# Altium project ACU (ra8m1_unshielded).PrjPcb (part 2 of 3)

## Sheet HighSpeedInterfaces.SchDoc: High Speed Interfaces
size A3; ApprovedBy: Diogo Gomes; CheckedBy: Bruno, Candido, Pedro; Author: João Vieira; CompanyName: LART; DrawnBy: João Vieira; Organization: LART; Address1: Morro do lena; Address2: Alto Do Vieiro; Address3: APT 4163, Building D; Revision: v1.4.2; SheetNumber: 7; SheetTotal: 12; ProjectTitle: Autonomous Control Unit; CheckedBy1: G. Candido; CheckedBy2: F. Chen; CheckedBy3: P. Ferreira; CheckedBy4: B. Vicente; CheckedBy5: _; CheckedBy6: _; CheckedBy7: _; CHK_APP_DATE: --/--/--; DSN_APP_DATE: --/--/--; ENG_APP_DATE: --/--/--; Summary: The various High Speed IOs, for now this only includes Ethernet; version_tag: 1.4.2; ImagePath: C:\Users\micron\Desktop
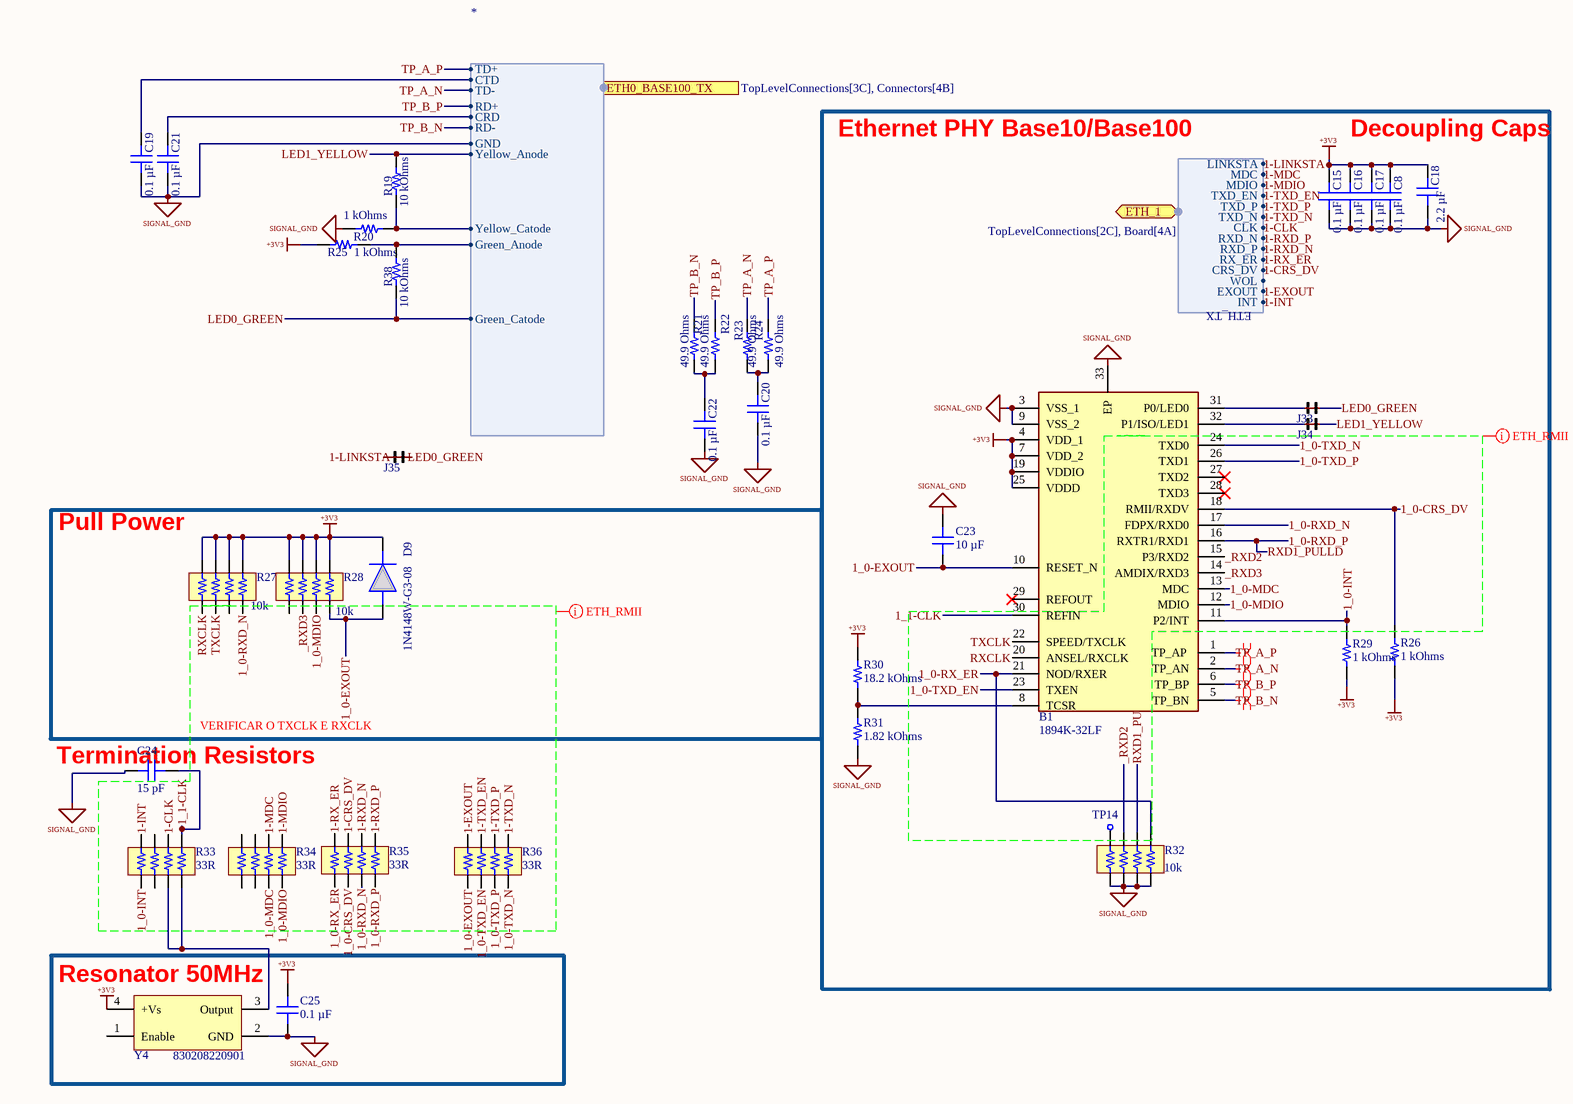
[diagram p5: HighSpeedInterfaces.SchDoc]

### Parts
(Parts that share a designator on the sheet are numbered #1, #2 ... from top to bottom, then left to right.)
B1  1894K-32LF  [1894K-32LF]
C8  0.1 µF  [CAP 0402_1005]
C15#2  0.1 µF  [CAP 0402_1005]
C16#2  0.1 µF  [CAP 0402_1005]
C17#2  0.1 µF  [CAP 0402_1005]
C18  2.2 µF  [CAP 0805_2012]
C19  0.1 µF  [CAP 0402_1005]
C20  0.1 µF  [CAP 0402_1005]
C21  0.1 µF  [CAP 0402_1005]
C22  0.1 µF  [CAP 0402_1005]
C23  10 µF  [CAP 0805_2012]
C24  15 pF  [CAP 0402_1005]
C25#2  0.1 µF  [CAP 0402_1005]
D9  1N4148W-G3-08  [SOD3716X135N]
J33  A solder Bridge  [Solder Bridge 805]  (value not drawn)
J34  A solder Bridge  [Solder Bridge 805]  (value not drawn)
J35  A solder Bridge  [Solder Bridge 805]  (value not drawn)
R19  10 kOhms  [RES 0805_2012]
R20  1 kOhms  [RES 0805_2012]
R21  49.9 Ohms  [RES 0402_1005]
R22  49.9 Ohms  [RES 0402_1005]
R23  49.9 Ohms  [RES 0402_1005]
R24  49.9 Ohms  [RES 0402_1005]
R25  1 kOhms  [RES 0805_2012]
R26  1 kOhms  [RES 0805_2012]
R27  10k  [RESNET 1206-8 CONVEX]
R28  10k  [RESNET 1206-8 CONVEX]
R29  1 kOhms  [RES 0805_2012]
R30  18.2 kOhms  [RES 0805_2012]
R31  1.82 kOhms  [RES 0805_2012]
R32  10k  [RESNET 1206-8 CONVEX]
R33  33R  [RESNET 0804-8 CONVEX]
R34  33R  [RESNET 0804-8 CONVEX]
R35  33R  [RESNET 0804-8 CONVEX]
R36  33R  [RESNET 0804-8 CONVEX]
R38  10 kOhms  [RES 0805_2012]
TP14  TestPad  [Test Pad Small]  (value not drawn)
Y4#2  830208220901  [WE-SPXO_IQXO-791]

### Blocks framed on the sheet
Pull Power: D9 R27 R28
Resonator 50MHz: C25#2 Y4#2

### Ports
ETH0_BASE100_TX (harness *, see TopLevelConnections[3C], Connectors[4B]), ETH_1 (bidir, harness ETH_TX, see TopLevelConnections[2C], Board[4A])

### Harnesses
ETH_TX: MDC, MDIO, TXD_EN, TXD_P, TXD_N, CLK, RXD_N, RXD_P, RX_ER, LINKSTA, CRS_DV, WOL, EXOUT, INT
*: TD+, CTD, TD-, RD+, CRD, RD-, GND, Yellow_Anode, Yellow_Catode, Green_Anode, Green_Catode

### Nets
+3V3: B1.4(VDD_1) B1.7(VDD_2) B1.19(VDDIO) B1.25(VDDD) C8.2 C15#2.2 C16#2.2 C17#2.2 C18.2 C25#2.1 D9.1(K) R25.2 R26.2 R27.1 R27.2 R27.3 R27.4 R28.5 R28.6 R28.7 R28.8 R29.2 R30.2 Y4#2.4(+Vs)
SIGNAL_GND: B1.3(VSS_1) B1.9(VSS_2) B1.33(EP) C8.1 C15#2.1 C16#2.1 C17#2.1 C18.1 C19.1 C20.1 C21.1 C22.1 C23.2 C24.2 C25#2.2 R20.2 R31.1 R32.1 R32.2 R32.3 R32.4 Y4#2.2(GND) ; port ETH0_BASE100_TX.GND
1-CLK: R33.6 ; port ETH_1.CLK
1-CRS_DV: R35.7 ; port ETH_1.CRS_DV
1-EXOUT: R36.8 ; port ETH_1.EXOUT
1-INT: R33.8 ; port ETH_1.INT
1-LINKSTA: J35.P0 ; port ETH_1.LINKSTA
1-MDC: R34.6 ; port ETH_1.MDC
1-MDIO: R34.5 ; port ETH_1.MDIO
1-RX_ER: R35.8 ; port ETH_1.RX_ER
1-RXD_N: R35.6 ; port ETH_1.RXD_P
1-RXD_P: R35.5 ; port ETH_1.RXD_N
1-TXD_EN: R36.7 ; port ETH_1.TXD_EN
1-TXD_N: R36.5 ; port ETH_1.TXD_N
1-TXD_P: R36.6 ; port ETH_1.TXD_P
1_0-CRS_DV: B1.18(RMII/RXDV) R26.1 R35.2  [project net 1_0-CRS_DV_7]
1_0-EXOUT: B1.10(RESET_N) C23.1 D9.2(A) R28.4 R36.1  [project net 1_0-EXOUT_7]
1_0-INT: B1.11(P2/INT) R29.1 R33.1  [project net 1_0-INT_7]
1_0-MDC: B1.13(MDC) R34.3  [project net 1_0-MDC_7]
1_0-MDIO: B1.12(MDIO) R28.3 R34.4  [project net 1_0-MDIO_7]
1_0-RX_ER: B1.21(NOD/RXER) R32.5 R35.1  [project net 1_0-RX_ER_7]
1_0-RXD_N: B1.17(FDPX/RXD0) R27.8 R35.3  [project net 1_0-RXD_N_7]
1_0-RXD_P: B1.16(RXTR1/RXD1) R32.6 R35.4  [also labelled RXD1_PULLD]  [project net 1_0-RXD_P_7]
1_0-TXD_EN: B1.23(TXEN) R36.2  [project net 1_0-TXD_EN_7]
1_0-TXD_N: B1.24(TXD0) R36.4  [project net 1_0-TXD_N_7]
1_0-TXD_P: B1.26(TXD1) R36.3  [project net 1_0-TXD_P_7]
1_1-CLK: B1.30(REFIN) C24.1 R33.5  [project net 1_1-CLK_7]
_RXD2: B1.15(P3/RXD2) R32.7  [project net _RXD2_7]
_RXD3: B1.14(AMDIX/RXD3) R28.2  [project net _RXD3_7]
LED0_GREEN: J33.P1 J35.P1 R38.1 ; port ETH0_BASE100_TX.Green_Catode
LED1_YELLOW: J34.P1 R19.2 ; port ETH0_BASE100_TX.Yellow_Anode
RXCLK: B1.20(ANSEL/RXCLK) R27.5  [project net RXCLK_7]
TP_A_N: B1.2(TP_AN) R23.2 ; port ETH0_BASE100_TX.TD-
TP_A_P: B1.1(TP_AP) R24.2 ; port ETH0_BASE100_TX.TD+
TP_B_N: B1.5(TP_BN) R21.2 ; port ETH0_BASE100_TX.RD-
TP_B_P: B1.6(TP_BP) R22.2 ; port ETH0_BASE100_TX.RD+
TXCLK: B1.22(SPEED/TXCLK) R27.6  [project net TXCLK_7]
NetB1_8: B1.8(TCSR) R30.1 R31.2
NetB1_31: B1.31(P0/LED0) J33.P0
NetB1_32: B1.32(P1/ISO/LED1) J34.P0
NetC19_2: C19.2 ; port ETH0_BASE100_TX.CTD
NetC20_2: C20.2 R23.1 R24.1
NetC21_2: C21.2 ; port ETH0_BASE100_TX.CRD
NetC22_2: C22.2 R21.1 R22.1
NetR19_1: R19.1 R20.1 ; port ETH0_BASE100_TX.Yellow_Catode
NetR25_1: R25.1 R38.2 ; port ETH0_BASE100_TX.Green_Anode
NetR32_8: R32.8 TP14.P2
NetR33_3: R33.3 R33.4 Y4#2.3(Output)

Not connected (* = marked no-connect by the designer): B1 27(TXD2)* 28(TXD3)* 29(REFOUT)*; R27 7; R28 1; R33 2 7; R34 1 2 7 8; Y4#2 1(Enable)

### Layout directives
differential pair; rule Impedance Constraint [Min = 99.00    Max = 101.0    ]; differential pair class ETH_B; rule Matched Net Lengths [Delay Tolerance = 10ps]; rule Differential Pairs Routing [Pref Gap = 0.127mm    Min Gap  = 0.127mm    Max Gap  = 0.127mmPref Width = 0.108mm    Min Width  = 0.076mm    Max Width  = 0.108mm]: TP_B_P
differential pair; rule Impedance Constraint [Min = 99.00    Max = 101.0    ]; rule Impedance Constraint [Min = 99.00    Max = 101.0    ]; differential pair class ETH_B; rule Matched Net Lengths [Delay Tolerance = 10ps]; rule Differential Pairs Routing [Pref Gap = 0.127mm    Min Gap  = 0.127mm    Max Gap  = 0.127mmPref Width = 0.108mm    Min Width  = 0.076mm    Max Width  = 0.108mm]: TP_B_N
differential pair; differential pair class ETH_A; rule Matched Net Lengths [Delay Tolerance = 10ps]; rule Differential Pairs Routing [Pref Gap = 0.127mm    Min Gap  = 0.127mm    Max Gap  = 0.127mmPref Width = 0.108mm    Min Width  = 0.076mm    Max Width  = 0.108mm]: TP_A_P
differential pair; rule Impedance Constraint [Min = 99.00    Max = 101.0    ]; differential pair class ETH_A; rule Matched Net Lengths [Delay Tolerance = 10ps]; rule Differential Pairs Routing [Pref Gap = 0.127mm    Min Gap  = 0.127mm    Max Gap  = 0.127mmPref Width = 0.108mm    Min Width  = 0.076mm    Max Width  = 0.108mm]: TP_A_N
rule Width Constraint [Pref Impedance = 50.00ohms    Min Impedance = 50.00ohms    Max Impedance = 50.00ohms]: 1-CLK, 1-CRS_DV, 1-EXOUT, 1-INT, 1-MDC, 1-MDIO, 1-RX_ER, 1-RXD_N, 1-RXD_P, 1-TXD_EN, 1-TXD_N, 1-TXD_P, 1_0-CRS_DV, 1_0-EXOUT, 1_0-INT, 1_0-MDC, 1_0-MDIO, 1_0-RX_ER, 1_0-RXD_N, 1_0-RXD_P, 1_0-TXD_EN, 1_0-TXD_N, 1_0-TXD_P, 1_1-CLK, _RXD2, _RXD3, RXCLK, RXD1_PULLD, TXCLK

### Notes on the sheet
- Ethernet PHY Base10/Base100
- Decoupling Caps
- (near C24) VERIFICAR O TXCLK E RXCLK
- (near C24) Termination Resistors
- Title:
- Author:
- Checked By:
- Approved:
- Size:
- Date:
- Git Hash:
- A3
- Prj:
- Variant:
- SW Version:
- Description:

### Library data of the parts
B1 = 1894K-32LF: The IDT1894-32 is a low-power, physical-layer device (PHY) that supports the ISO/IEC 10Base-T and 100Base-TX Carrier-Sense Multiple Access/Collision Detection (CSMA/CD) Ethernet standards, ISO/IEC 8802-3. The IDT1894-32 is intended for MII, Node applications that require the Auto-MDIX feature that automatically corrects crossover errors in plant wiring. The IDT1894-32 incorporates Digital-Signal Processing (DSP) control in its Physical-Medium Dependent (PMD) sub layer. As a result, it can transmit and recei; Manufacturer_Name: Renesas Electronics; Geometry.Height: 1mm; Manufacturer_Part_Number: 1894K-32LF; Mouser Part Number: 972-1894K-32LF; Mouser Price/Stock: https://www.mouser.co.uk/ProductDetail/Renesas-IDT/1894K-32LF?qs=JcGQCygHkIbsoRijcJxryA%3D%3D; Arrow Part Number: *; Arrow Price/Stock: *; Datasheet Link: https://www.idt.com/document/dst/1894-32-datasheet
C8 C15#2 C16#2 C17#2 C19-C22 C25#2 = CL05B104KP5VPNC: CAP CER 100NF 10V X7R 0402; manufacturer: Samsung Electro-Mechanics; Tolerance: ±10%; Part Number: CL05B104KP5VPNC; Value: 0.1 µF; Applications: Automotive; Capacitance: 0.1 µF; componentlink1description: Datasheet; componentlink1url: https://mm.digikey.com/Volume0/opasdata/d220001/medias/docus/5458/CL05B104KP5VPNC_Spec.pdf; componentlink2description: DigiKey Link; componentlink2url: https://www.digikey.com/en/products/detail/samsung-electro-mechanics/CL05B104KP5VPNC/20498482; Device Package: 0402 (1005 Metric); lastupdated: 02/02/2024 20:03:11; Lifecycle Status: Active; Minimum Order: 1; Mounting Type: Surface Mount, MLCC; Operating Temperature: -55°C ~ 125°C; Package / Case: 0402 (1005 Metric); packaging: TapeAndReel; partid: 56690; price: 0.01; Ratings: AEC-Q200; series: CL; Size / Dimension: 0.039" L x 0.020" W (1.00mm x 0.50mm); Supplier 1: DigiKey; Supplier Part Number 1: 1276-CL05B104KP5VPNCCT-ND; Temperature Coefficient: X7R; Thickness (Max): 0.022" (0.55mm); Voltage - Rated: 10V
C18 = 0805B225K250CT: CAP CER 2.2UF 25V X7R 0805; manufacturer: Walsin Technology Corporation; Tolerance: ±10%; Part Number: 0805B225K250CT; Value: 2.2 µF; Applications: General Purpose; Capacitance: 2.2 µF; componentlink1description: Datasheet; componentlink1url: https://www.passivecomponent.com/wp-content/uploads/datasheet/WTC_MLCC_General_Purpose.pdf; componentlink2description: DigiKey Link; componentlink2url: https://www.digikey.com/en/products/detail/walsin-technology-corporation/0805B225K250CT/14836806; Device Package: 0805 (2012 Metric); lastupdated: 09/02/2024 20:15:01; Lifecycle Status: Active; Minimum Order: 1; Mounting Type: Surface Mount, MLCC; Operating Temperature: -55°C ~ 125°C; Package / Case: 0805 (2012 Metric); packaging: TapeAndReel; partid: 40661; Part Status: Active; price: 0.03; series: -; Size / Dimension: 0.079" L x 0.049" W (2.00mm x 1.25mm); Supplier 1: DigiKey; Supplier Part Number 1: 1292-0805B225K250CT-ND; Temperature Coefficient: X7R; Thickness (Max): 0.057" (1.45mm); Voltage - Rated: 25V
C23 = NMC0805X5R106K6.3TRPLP2KF: CAP SMT080510F6.3VDC 10uF Specialised; manufacturer: NIC Components Corp; Temperature Coefficient: X5R; Tolerance: ±10%; Voltage - Rated: 6.3V; Part Number: NMC0805X5R106K6.3TRPLP2KF; Value: 10 µF; Applications: General Purpose; Capacitance: 10 µF; componentlink1description: Datasheet; componentlink1url: https://www.niccomp.com/quickbuilder/qbpn.php?pNumber=NMC0805X5R106K6.3TRPLP2KF; componentlink2description: DigiKey Link; componentlink2url: https://www.digikey.com/en/products/detail/nic-components-corp/NMC0805X5R106K6-3TRPLP2KF/18896026; Device Package: 0805 (2012 Metric); Features: Low ESL, Low ESR; lastupdated: 09/02/2024 20:13:27; Lifecycle Status: Active; Minimum Order: 1; Mounting Type: Surface Mount, MLCC; Operating Temperature: -55°C ~ 85°C; Package / Case: 0805 (2012 Metric); packaging: TapeAndReel; partid: 56029; price: 0.03; series: NMC High CV; Size / Dimension: 0.079" L x 0.049" W (2.00mm x 1.25mm); Supplier 1: DigiKey; Supplier Part Number 1: 4988-NMC0805X5R106K6.3TRPLP2KFCT-ND; Thickness (Max): 0.057" (1.45mm)
C24 = CBR04C150J5GAC: CAP CER 15PF 50V C0G/NP0 0402; manufacturer: KEMET; Temperature Coefficient: C0G, NP0; Tolerance: ±5%; Part Number: CBR04C150J5GAC; Value: 15 pF; Applications: RF, Microwave, High Frequency; Capacitance: 15 pF; componentlink1description: Datasheet; componentlink1url: https://api.kemet.com/component-edge/download/datasheet/CBR04C150J5GAC.pdf; componentlink2description: DigiKey Link; componentlink2url: https://www.digikey.com/en/products/detail/kemet/CBR04C150J5GAC/2732287; Device Package: 0402 (1005 Metric); Features: High Q, Low Loss, Ultra Low ESR; lastupdated: 09/02/2024 20:04:38; Lifecycle Status: Active; Minimum Order: 1; Mounting Type: Surface Mount, MLCC; Operating Temperature: -55°C ~ 125°C; Package / Case: 0402 (1005 Metric); packaging: TapeAndReel; partid: 1728; Part Status: Active; price: 0.02; series: CBR-SMD RF C0G; Size / Dimension: 0.039" L x 0.020" W (1.00mm x 0.50mm); Supplier 1: DigiKey; Supplier Part Number 1: 399-6170-1-ND; Thickness (Max): 0.022" (0.55mm); Voltage - Rated: 50V
D9 = 1N4148W-G3-08: Diodes - General Purpose, Power, Switching 100 Volt 150mA 4ns 500mA IFSM; Manufacturer_Name: Vishay; Geometry.Height: 1.35mm; Manufacturer_Part_Number: 1N4148W-G3-08; Mouser Part Number: 78-1N4148W-G3-08; Mouser Price/Stock: https://www.mouser.co.uk/ProductDetail/Vishay-Semiconductors/1N4148W-G3-08?qs=uS%252BVSIFnvp46StDBB15x4Q%3D%3D; Arrow Part Number: 1N4148W-G3-08; Arrow Price/Stock: https://www.arrow.com/en/products/1n4148w-g3-08/vishay; Datasheet Link: https://componentsearchengine.com/Datasheets/1/1N4148W-G3-08.pdf
J33-J35 = Solder Bridge 805
R19 R38 = RNCS0805BKE10K0: RES 10K OHM 0.1% 1/10W 0805; Manufacturer: Stackpole Electronics Inc; Power (Watts): 0.1W, 1/10W; Temperature Coefficient: ±25ppm/°C; Part Number: RNCS0805BKE10K0; Value: 10 kOhms; ComponentLink1Description: Datasheet; ComponentLink1URL: https://www.seielect.com/catalog/sei-rncs_rnch.pdf; ComponentLink2Description: DigiKey Link; ComponentLink2URL: https://www.digikey.com/en/products/detail/stackpole-electronics-inc/RNCS0805BKE10K0/1800067; Composition: Thin Film; Device Package: 0805 (2012 Metric); Features: Anti-Corrosive, Automotive AEC-Q200, Moisture Resistant; Height - Seated (Max): 0.026" (0.65mm); LastUpdated: 02/02/2024 21:00:48; Lifecycle Status: Active; Minimum Order: 1; Number of Terminations: 2; Operating Temperature: -55°C ~ 155°C; Package / Case: 0805 (2012 Metric); Packaging: TapeAndReel; PartId: 27713; Part Status: Active; Price: 0.07; Ratings: AEC-Q200; Resistance: 10 kOhms; Series: RNCS; Size / Dimension: 0.079" L x 0.049" W (2.00mm x 1.25mm); Supplier 1: DigiKey; Supplier Part Number 1: RNCS0805BKE10K0CT-ND; Supplier Device Package: 0805; Tolerance: ±0.1%
R20 R25 R26 R29 = RNCS0805BKE1K00: RES 1K OHM 0.1% 1/10W 0805; Manufacturer: Stackpole Electronics Inc; Power (Watts): 0.1W, 1/10W; Temperature Coefficient: ±25ppm/°C; Part Number: RNCS0805BKE1K00; Value: 1 kOhms; ComponentLink1Description: Datasheet; ComponentLink1URL: https://www.seielect.com/catalog/sei-rncs_rnch.pdf; ComponentLink2Description: DigiKey Link; ComponentLink2URL: https://www.digikey.com/en/products/detail/stackpole-electronics-inc/RNCS0805BKE1K00/1800073; Composition: Thin Film; Device Package: 0805 (2012 Metric); Features: Anti-Corrosive, Automotive AEC-Q200, Moisture Resistant; Height - Seated (Max): 0.026" (0.65mm); LastUpdated: 02/02/2024 21:00:48; Lifecycle Status: Active; Minimum Order: 1; Number of Terminations: 2; Operating Temperature: -55°C ~ 155°C; Package / Case: 0805 (2012 Metric); Packaging: TapeAndReel; PartId: 27715; Part Status: Active; Price: 0.07; Ratings: AEC-Q200; Resistance: 1 kOhms; Series: RNCS; Size / Dimension: 0.079" L x 0.049" W (2.00mm x 1.25mm); Supplier 1: DigiKey; Supplier Part Number 1: RNCS0805BKE1K00CT-ND; Supplier Device Package: 0805; Tolerance: ±0.1%
R21-R24 = CRCW040249R9FKTD: RES SMD 49.9 OHM 1% 1/16W 0402; Manufacturer: Vishay Dale; Power (Watts): 0.063W, 1/16W; Temperature Coefficient: ±100ppm/°C; Part Number: CRCW040249R9FKTD; Value: 49.9 Ohms; ComponentLink1Description: Datasheet; ComponentLink1URL: http://www.vishay.com/docs/20008/dcrcw.pdf; ComponentLink2Description: DigiKey Link; ComponentLink2URL: https://www.digikey.com/en/products/detail/vishay-dale/CRCW040249R9FKTD/1221372; Composition: Thick Film; Device Package: 0402 (1005 Metric); Features: Automotive AEC-Q200; Height - Seated (Max): 0.016" (0.40mm); LastUpdated: 09/02/2024 20:30:10; Lifecycle Status: Active; Minimum Order: 1; Number of Terminations: 2; Operating Temperature: -55°C ~ 155°C; Package / Case: 0402 (1005 Metric); Packaging: TapeAndReel; PartId: 5707; Part Status: Active; Price: 0.01; Ratings: AEC-Q200; Resistance: 49.9 Ohms; Series: CRCW; Size / Dimension: 0.039" L x 0.020" W (1.00mm x 0.50mm); Supplier 1: DigiKey; Supplier Part Number 1: 541-2963-1-ND; Supplier Device Package: 0402; Tolerance: ±1%
R27 R28 R32 = ACASA1001S1002P100: RES ARRAY 4 RES MULT OHM 1206; Manufacturer: Vishay Beyschlag; Circuit Type: Isolated; Number of Resistors: 4; Power Per Element: 100mW; Resistance (Ohms): 1k, 10k; Resistor Matching Ratio: ±0.05%; Resistor-Ratio-Drift: ±15ppm/°C; Temperature Coefficient: ±25ppm/°C; Tolerance: ±0.1%; Part Number: ACASA1001S1002P100; Applications: Voltage Divider (TCR Matched); ComponentLink1Description: Datasheet; ComponentLink1URL: http://www.vishay.com/docs/28751/acasprec.pdf; ComponentLink2Description: DigiKey Link; ComponentLink2URL: http://digikey.com/product-detail/en/vishay-beyschlag/ACASA1001S1002P100/749-1017-1-ND/4741023; Height - Seated (Max): 0.022" (0.55mm); LastUpdated: 02/02/2024 21:35:30; Lifecycle Status: Active; Minimum Order: 1; Mounting Type: Surface Mount; Number of Pins: 8; Operating Temperature: -55°C ~ 125°C; Package / Case: 1206 (3216 Metric), Convex, Long Side Terminals; Packaging: TapeAndReel; PartId: 354; Part Status: Active; Price: 0.24; Series: ACA - Precision; Size / Dimension: 0.126" L x 0.059" W (3.20mm x 1.50mm); Supplier 1: DigiKey; Supplier Part Number 1: 749-1017-1-ND
R30 = RN73C2A18K2BTDF: RES SMD 18.2KOHM 0.1% 1/10W 0805; Manufacturer: TE Connectivity Passive Product; Power (Watts): 0.1W, 1/10W; Temperature Coefficient: ±10ppm/°C; Part Number: RN73C2A18K2BTDF; Value: 18.2 kOhms; ComponentLink1Description: Datasheet; ComponentLink1URL: https://www.te.com/commerce/DocumentDelivery/DDEController?Action=srchrtrv&DocNm=1773270&DocType=DS&DocLang=English; ComponentLink2Description: DigiKey Link; ComponentLink2URL: https://www.digikey.com/en/products/detail/te-connectivity-passive-product/RN73C2A18K2BTDF/2373970; Composition: Thin Film; Device Package: 0805 (2012 Metric); Height - Seated (Max): 0.026" (0.65mm); LastUpdated: 08/02/2024 21:02:38; Lifecycle Status: Active; Minimum Order: 1; Number of Terminations: 2; Operating Temperature: -55°C ~ 155°C; Package / Case: 0805 (2012 Metric); Packaging: TapeAndReel; PartId: 27941; Part Status: Active; Price: 0.36; Resistance: 18.2 kOhms; Series: RN73, Holsworthy; Size / Dimension: 0.079" L x 0.049" W (2.00mm x 1.25mm); Supplier 1: DigiKey; Supplier Part Number 1: A103339CT-ND; Supplier Device Package: 0805; Tolerance: ±0.1%
R31 = RG2012P-1821-B-T5: RES SMD 1.82K OHM 0.1% 1/8W 0805; Manufacturer: Susumu; Power (Watts): 0.125W, 1/8W; Temperature Coefficient: ±25ppm/°C; Part Number: RG2012P-1821-B-T5; Value: 1.82 kOhms; ComponentLink1Description: Datasheet; ComponentLink1URL: http://www.susumu.co.jp/common/pdf/n_catalog_partition01_en.pdf; ComponentLink2Description: DigiKey Link; ComponentLink2URL: https://www.digikey.com/en/products/detail/susumu/RG2012P-1821-B-T5/1240695; Composition: Thin Film; Device Package: 0805 (2012 Metric); Features: Anti-Sulfur, Automotive AEC-Q200; Height - Seated (Max): 0.020" (0.50mm); LastUpdated: 08/02/2024 21:02:32; Lifecycle Status: Active; Minimum Order: 1; Number of Terminations: 2; Operating Temperature: -55°C ~ 155°C; Package / Case: 0805 (2012 Metric); Packaging: TapeAndReel; PartId: 29209; Part Status: Active; Price: 0.05; Ratings: AEC-Q200; Resistance: 1.82 kOhms; Series: RG; Size / Dimension: 0.079" L x 0.049" W (2.00mm x 1.25mm); Supplier 1: DigiKey; Supplier Part Number 1: RG20P1.82KBCT-ND; Supplier Device Package: 0805; Tolerance: ±0.1%
R33-R36 = EXB-28V433JX: RES ARRAY 4 RES 43K OHM 0804; Manufacturer: Panasonic Electronic Components; Circuit Type: Isolated; Number of Resistors: 4; Power Per Element: 62.5mW; Temperature Coefficient: ±200ppm/°C; Tolerance: ±5%; Part Number: EXB-28V433JX; Applications: Automotive AEC-Q200; ComponentLink1Description: Datasheet; ComponentLink1URL: https://industrial.panasonic.com/cdbs/www-data/pdf/AOC0000/AOC0000C14.pdf; ComponentLink2Description: DigiKey Link; ComponentLink2URL: https://www.digikey.com/en/products/detail/panasonic-electronic-components/EXB-28V433JX/417403; Height - Seated (Max): 0.018" (0.45mm); LastUpdated: 02/02/2024 21:35:40; Lifecycle Status: Active; Minimum Order: 1; Mounting Type: Surface Mount; Number of Pins: 8; Operating Temperature: -55°C ~ 125°C; Package / Case: 0804, Convex, Long Side Terminals; Packaging: TapeAndReel; PartId: 428; Part Status: Active; Price: 0.03; Resistance (Ohms): 43k; Series: EXB; Size / Dimension: 0.079" L x 0.039" W (2.00mm x 1.00mm); Supplier 1: DigiKey; Supplier Part Number 1: Y7433CT-ND; Supplier Device Package: 0804
Y4#2 = 830208220901: WE-SPXO Simple Packaged Quartz Oscillator, SMT, IQXO-791, 50MHz, 3.3V; Manufacturer: Wurth Elektronik; Frequency Stability: +/-25ppm; ComponentLink1Description: Website Link; ComponentLink1URL: https://www.we-online.com/redexpert/article/830208220901?ad; ComponentLink2Description: Datasheet Link; ComponentLink2URL: https://www.we-online.com/redexpert/spec/830208220901?ad; Manufacturer Part Number: 830208220901; Category: Oscillators; Match Code: WE-SPXO; Mount: Surface Mount; Operating Temperature Max: 70°C; Operating Temperature Min: -20°C; Packaging: Tape and Reel; Case/Size Code: IQXO-791; Length: 2.5mm; Width: 2mm; Height: 1mm; Frequency: 50MHz; Supply Voltage: 3.3V

## Sheet Power.SchDoc: Power
size A3; ApprovedBy: Diogo Gomes; CheckedBy: Bruno, Candido, Pedro; Author: João Vieira; CompanyName: LART; DrawnBy: João Vieira; Organization: LART; Address1: Morro do lena; Address2: Alto Do Vieiro; Address3: APT 4163, Building D; Revision: v1.4.2; SheetNumber: 8; SheetTotal: 12; ProjectTitle: Autonomous Control Unit; CheckedBy1: G. Candido; CheckedBy2: F. Chen; CheckedBy3: P. Ferreira; CheckedBy4: B. Vicente; CheckedBy5: _; CheckedBy6: _; CheckedBy7: _; CHK_APP_DATE: --/--/--; DSN_APP_DATE: --/--/--; ENG_APP_DATE: --/--/--; Summary: Includes the various reference voltages needed to power all the chips in the ACU; version_tag: 1.4.2; SPICEModelCacheBATJKBWV: <root> / <DocumentId>BATJKBWV</DocumentId> / <CacheFrame Number="0"> / <Model Name="1280_74477005_5.6u" Kind="CKT"> / <Text>******* / .subckt 1280_74477005_5.6u 1 2 / Rp 1 2 5511 / Cp 1 2 8p / Rs 1 N3 0.0105 / L1 N3 2 5.464u / .ends 1280_74477005_5.6u</Text> / </Model> / <Model Name="865060440001_10uf" Kind="CKT"> / <Text>******* / .subckt 865060440001_10uF 1 2 / Rser 1 3 1.81968584275 / Lser 2 4 1.435032181E-09 / C1 3 4 0.00001 / Rpar 3 4 8333333.33333333 / .ends 865060440001_10uF</Text> / </Model> / </CacheFrame> / </root>; ImagePath: C:\Users\micron\Desktop
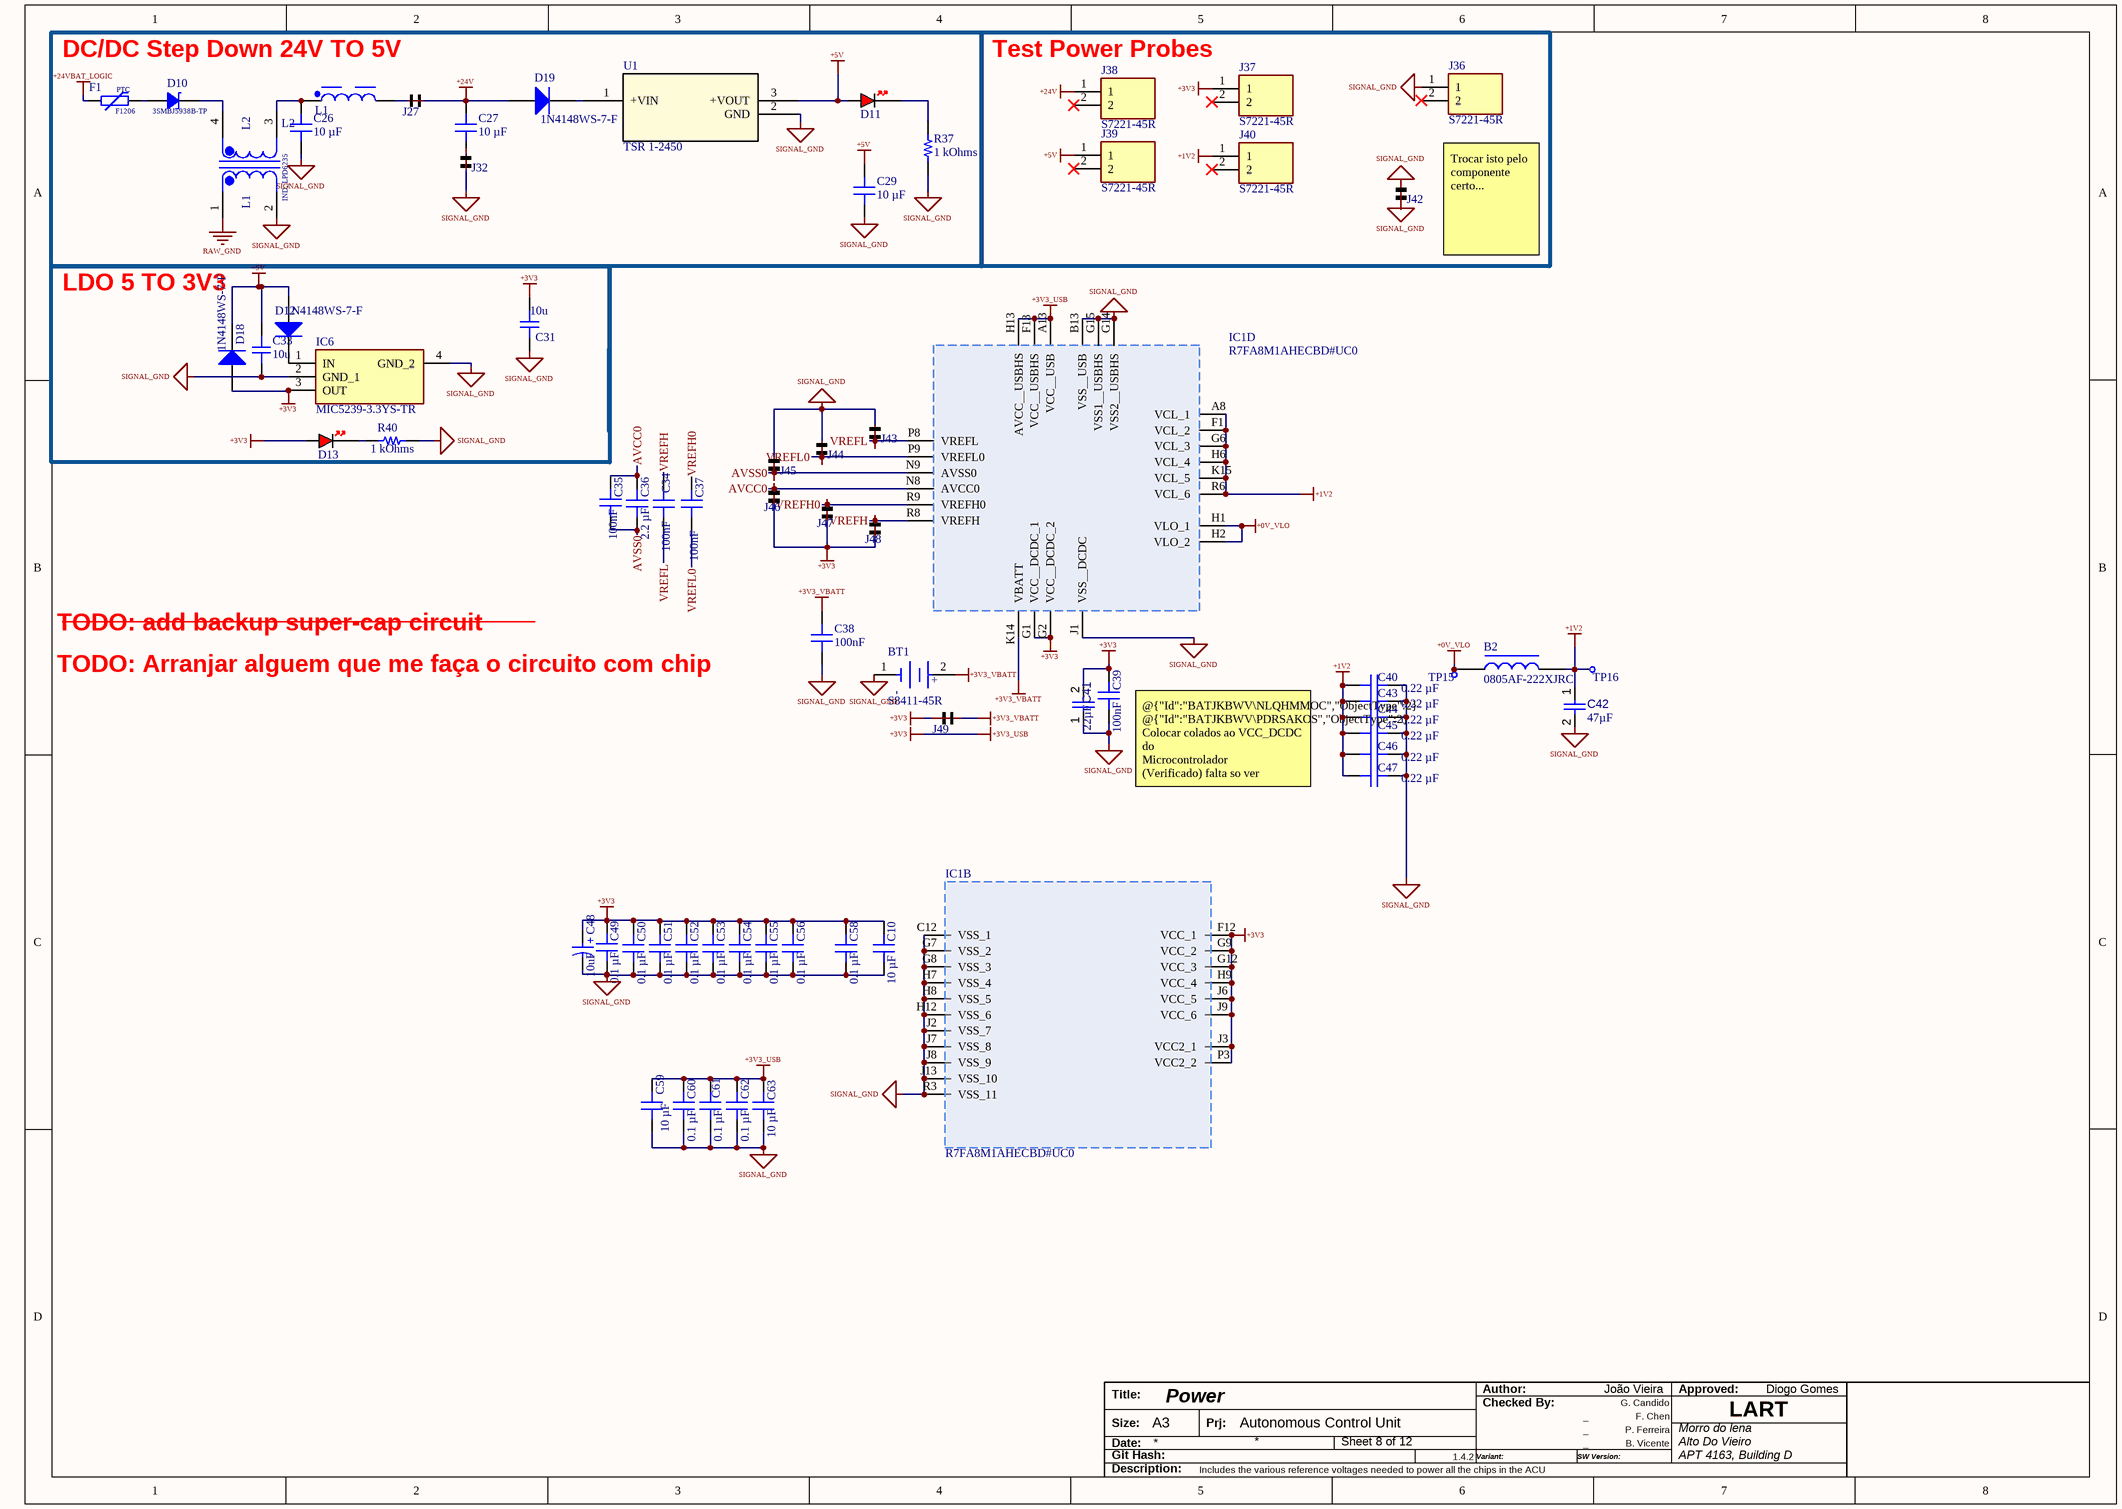
[diagram p6: Power.SchDoc]

### Parts
(Parts that share a designator on the sheet are numbered #1, #2 ... from top to bottom, then left to right.)
B2  0805AF-222XJRC  [INDC2317X152N]
BT1  S8411-45R  [FP-S8411-45R-MFG]
C10  value 10 µF  [CAP 0805_2012]  (hidden comment: 0.1uF 0805)
C26#2  10 µF  [CAP 0805_2012]
C27  10 µF  [CAP 0805_2012]
C29#2  10 µF  [CAP 0805_2012]
C31#2  10u  [CAP_0805]
C33  10u  [CAP_0805]
C34  value 100nF  [CAP 0805_2012]  (hidden comment: 0.1uF)
C35  value 100nF  [CAP 0805_2012]  (hidden comment: 0.1uF)
C36  value 2.2 µF  [CAP 0805_2012]  (hidden comment: 2.2uF)
C37  value 100nF  [CAP 0805_2012]  (hidden comment: 0.1uF)
C38  value 100nF  [CAP 0805_2012]  (hidden comment: 0.1uF)
C39  value 100nF  [CAP 0805_2012]  (hidden comment: 0.1uF)
C40  0.22 µF  [CAP 0201_0603]
C41  value 22µF  [CAPC0805(2012)145_L]  (hidden comment: Capacitor 22µF +/-40% 16V 0805)
C42  value 47µF  [CAPC0805(2012)145_L]  (hidden comment: 47uF)
C43  0.22 µF  [CAP 0201_0603]
C44  0.22 µF  [CAP 0201_0603]
C45  0.22 µF  [CAP 0201_0603]
C46  0.22 µF  [CAP 0201_0603]
C47  0.22 µF  [CAP 0201_0603]
C48  10uF  [WCAP-ASLL_D4H5.5]
C49  0.1 µF  [CAP 0201_0603]
C50  0.1 µF  [CAP 0201_0603]
C51  0.1 µF  [CAP 0201_0603]
C52  0.1 µF  [CAP 0201_0603]
C53  0.1 µF  [CAP 0201_0603]
C54  0.1 µF  [CAP 0201_0603]
C55  0.1 µF  [CAP 0201_0603]
C56  0.1 µF  [CAP 0201_0603]
C58  0.1 µF  [CAP 0201_0603]
C59  value 10 µF  [CAP 0805_2012]  (hidden comment: 10uF)
C60  0.1 µF  [CAP 0201_0603]
C61  0.1 µF  [CAP 0201_0603]
C62  0.1 µF  [CAP 0201_0603]
C63  value 10 µF  [CAP 0805_2012]  (hidden comment: 10uF)
D10  3SMBJ5938B-TP  [DO214AA SMB]
D11  RED  [LED_0603_RED]  (value not drawn)
D12  1N4148WS-7-F  [DIOD-SOD323-2-A_V]
D13  RED  [LED_0603_RED]  (value not drawn)
D18  1N4148WS-7-F  [DIOD-SOD323-2-A_V]
D19  1N4148WS-7-F  [DIOD-SOD323-2-A_V]
F1  F1206  [FUSE_1206]
IC1#2  R7FA8M1AHECBD#UC0  [RA8M1_BGA]  (parts B,D of 6)
IC6  MIC5239-3.3YS-TR  [SOT230P700X180-4N]
J27  A solder Bridge  [Solder Bridge 805]  (value not drawn)
J32  A solder Bridge  [Solder Bridge 805]  (value not drawn)
J36  S7221-45R  [S722145R]
J37  S7221-45R  [S722145R]
J38  S7221-45R  [S722145R]
J39  S7221-45R  [S722145R]
J40  S7221-45R  [S722145R]
J42  A solder Bridge  [Solder Bridge 805]  (value not drawn)
J43#2  A solder Bridge  [Solder Bridge 805]  (value not drawn)
J44#2  A solder Bridge  [Solder Bridge 805]  (value not drawn)
J45#2  A solder Bridge  [Solder Bridge 805]  (value not drawn)
J46#2  A solder Bridge  [Solder Bridge 805]  (value not drawn)
J47#2  A solder Bridge  [Solder Bridge 805]  (value not drawn)
J48#2  A solder Bridge  [Solder Bridge 805]  (value not drawn)
J49#2  A solder Bridge  [Solder Bridge 805 Open]  (value not drawn)
L1  5.6uH, 8.7A  [WE-PD_1280]  (value not drawn)
L2  IND_LPD6235  [IND_LPD6235]
R37  1 kOhms  [RES 0805_2012]
R40  1 kOhms  [RES 0805_2012]
TP15  TestPad  [Test Pad Small]  (value not drawn)
TP16#2  TestPad  [Test Pad Small]  (value not drawn)
U1  TSR 1-2450  [TSR1-SINGLE_TRP]

### Blocks framed on the sheet
DC/DC Step Down 24V TO 5V: C26#2 C27 C29#2 D10 D11 D19 F1 J27 J32 L1 L2 R37 U1
Test Power Probes: J36-J40 J42
LDO 5 TO 3V3: C31#2 C33 D12 D13 D18 IC6 R40

### Nets
+0V_VLO: B2.1 IC1#2.H1(VLO_1) IC1#2.H2(VLO_2) TP15.P2
+1V2: B2.2 C40.1 C42.1 C43.1 C44.1 C45.1 C46.1 C47.1 IC1#2.A8(VCL_1) IC1#2.F1(VCL_2) IC1#2.G6(VCL_3) IC1#2.H6(VCL_4) IC1#2.K15(VCL_5) IC1#2.R6(VCL_6) J40.1 TP16#2.P2
+3V3: C10.2 C31#2.2 C39.2 C41.2 C48.1(P) C49.2 C50.2 C51.2 C52.2 C53.2 C54.2 C55.2 C56.2 C58.2 C59.2 C60.2 C61.2 C62.2 C63.2 D13.A D18.1(A) IC1#2.A13(VCC__USB) IC1#2.F12(VCC_1) IC1#2.F13(VCC__USBHS) IC1#2.G1(VCC__DCDC_1) IC1#2.G2(VCC__DCDC_2) IC1#2.G9(VCC_2) IC1#2.G12(VCC_3) IC1#2.H9(VCC_4) IC1#2.H13(AVCC__USBHS) IC1#2.J3(VCC2_1) IC1#2.J6(VCC_5) IC1#2.J9(VCC_6) IC1#2.P3(VCC2_2) IC6.3(OUT) J37.1 J46#2.P0 J47#2.P0 J48#2.P0 J49#2.P0  [also labelled +3V3_USB]
+3V3_VBATT: BT1.2(A) C38.2 IC1#2.K14(VBATT) J49#2.P1
+5V: C29#2.2 C33.2 D11.A D12.1(A) D18.2(K) J39.1 U1.3(+VOUT)
+24V: C27.2 D19.1(A) J27.P0 J38.1
+24VBAT_LOGIC: F1.1
RAW_GND: L2.1
SIGNAL_GND: BT1.1(C) C10.1 C26#2.1 C29#2.1 C31#2.1 C33.1 C38.1 C39.1 C40.2 C41.1 C42.2 C43.2 C44.2 C45.2 C46.2 C47.2 C48.2(N) C49.1 C50.1 C51.1 C52.1 C53.1 C54.1 C55.1 C56.1 C58.1 C59.1 C60.1 C61.1 C62.1 C63.1 IC1#2.B13(VSS__USB) IC1#2.C12(VSS_1) IC1#2.G7(VSS_2) IC1#2.G8(VSS_3) IC1#2.G14(VSS2__USBHS) IC1#2.G15(VSS1__USBHS) IC1#2.H7(VSS_4) IC1#2.H8(VSS_5) IC1#2.H12(VSS_6) IC1#2.J1(VSS__DCDC) IC1#2.J2(VSS_7) IC1#2.J7(VSS_8) IC1#2.J8(VSS_9) IC1#2.J13(VSS_10) IC1#2.R3(VSS_11) IC6.2(GND_1) IC6.4(GND_2) J32.P0 J36.1 J42.P0 J42.P1 J43#2.P1 J44#2.P1 J45#2.P1 L2.2 R37.1 R40.2 U1.2(GND)
AVCC0: C35.2 C36.2 IC1#2.N8(AVCC0) J46#2.P1  [project net AVCC0_8]
AVSS0: C35.1 C36.1 IC1#2.N9(AVSS0) J45#2.P0  [project net AVSS0_8]
VREFH: C34.2 IC1#2.R8(VREFH) J48#2.P1  [project net VREFH_8]
VREFH0: C37.2 IC1#2.R9(VREFH0) J47#2.P1  [project net VREFH0_8]
VREFL: C34.1 IC1#2.P8(VREFL) J43#2.P0  [project net VREFL_8]
VREFL0: C37.1 IC1#2.P9(VREFL0) J44#2.P0  [project net VREFL0_8]
NetC26#2_2: C26#2.2 L1.1 L2.3
NetC27_1: C27.1 J32.P1
NetD10_1: D10.1 F1.2
NetD10_2: D10.2 L2.4
NetD11_K: D11.K R37.2
NetD12_2: D12.2(K) IC6.1(IN)
NetD13_K: D13.K R40.1
NetD19_2: D19.2(K) U1.1(+VIN)
NetJ27_P1: J27.P1 L1.2

Not connected (* = marked no-connect by the designer): J36 2*; J37 2*; J38 2*; J39 2*; J40 2*

### Notes on the sheet
- Trocar isto pelo componente certo...
- TODO: add backup super-cap circuit
- TODO: Arranjar alguem que me faça o circuito com chip
- (near C39) @{"Id":"BATJKBWV\NLQHMMOC","ObjectType":2} @{"Id":"BATJKBWV\PDRSAKOS","ObjectType":2} Colocar colados ao VCC_DCDC do
  Microcontrolador
  (Verificado) falta so ver datasheet para ver se foi erro da renesas
- Title:
- Author:
- Checked By:
- Approved:
- Size:
- Date:
- Git Hash:
- A3
- Prj:
- Variant:
- SW Version:
- Description:
- (in symbol 865060440001) +
- (in symbol CMP-00029-00001-1) +; -
- (in symbol FUSE_PPTC_1206) PTC
- (in symbol IND_LPD6235) L1

### Library data of the parts
B2 = 0805AF-222XJRC: COILCRAFT - 0805AF-222XJRC - Wirewound Inductor, 2.2 H, 0.98 ohm, 105 MHz, 350 mA, 0805 [2012 Metric], 0805AF Series; Geometry.Height: 1.52mm; Manufacturer_Name: COILCRAFT; Manufacturer_Part_Number: 0805AF-222XJRC; Mouser Part Number: *; Mouser Price/Stock: *; Arrow Part Number: *; Arrow Price/Stock: *; Datasheet Link: https://4donline.ihs.com/images/VipMasterIC/IC/COLC/COLC-S-A0013795668/COLC-S-A0013956448-1.pdf?hkey=6D3A4C79FDBF58556ACFDE234799DDF0
BT1 = CMP-00029-00001-1: Batteries/Accessories; RoHS Compliant: Yes
C10 C59 C63 = C2012X7R1A106K125AE: CAP CER 10UF 10V X7R 0805; manufacturer: TDK Corporation; Tolerance: ±10%; Part Number: C2012X7R1A106K125AE; Applications: Boardflex Sensitive; Capacitance: 10 µF; componentlink1description: Datasheet; componentlink1url: https://product.tdk.com/info/en/catalog/datasheets/mlcc_commercial_soft_en.pdf?ref_disty=digikey; componentlink2description: DigiKey Link; componentlink2url: https://www.digikey.com/en/products/detail/tdk-corporation/C2012X7R1A106K125AE/5809181; Device Package: 0805 (2012 Metric); Features: Soft Termination; lastupdated: 30/01/2024 20:15:17; Lifecycle Status: Active; Minimum Order: 1; Mounting Type: Surface Mount, MLCC; Operating Temperature: -55°C ~ 125°C; Package / Case: 0805 (2012 Metric); packaging: TapeAndReel; partid: 3036; Part Status: Active; price: 0.07; series: C; Size / Dimension: 0.079" L x 0.049" W (2.00mm x 1.25mm); Supplier 1: DigiKey; Supplier Part Number 1: 445-173616-1-ND; Temperature Coefficient: X7R; Thickness (Max): 0.059" (1.50mm); Voltage - Rated: 10V
C26#2 C27 C29#2 = CL21Y106KPQVPNE: CAP CER 10UF 10V X7S 0805; manufacturer: Samsung Electro-Mechanics; Tolerance: ±10%; Part Number: CL21Y106KPQVPNE; Value: 10 µF; Applications: Automotive; Capacitance: 10 µF; componentlink1description: Datasheet; componentlink1url: http://www.samsungsem.com/kr/support/product-search/mlcc/CL21Y106KPQVPNE.jsp; componentlink2description: DigiKey Link; componentlink2url: https://www.digikey.com/en/products/detail/samsung-electro-mechanics/CL21Y106KPQVPNE/5961169; Device Package: 0805 (2012 Metric); lastupdated: 06/02/2024 20:15:48; Lifecycle Status: Active; Minimum Order: 1; Mounting Type: Surface Mount, MLCC; Operating Temperature: -55°C ~ 125°C; Package / Case: 0805 (2012 Metric); packaging: TapeAndReel; partid: 2979; Part Status: Active; price: 0.06; Ratings: AEC-Q200; series: CL; Size / Dimension: 0.079" L x 0.049" W (2.00mm x 1.25mm); Supplier 1: DigiKey; Supplier Part Number 1: 1276-6685-1-ND; Temperature Coefficient: X7S; Thickness (Max): 0.055" (1.40mm); Voltage - Rated: 10V
C31#2 C33 = CAP_0805_10V: Capacitor SMD 0805 10V
C34 C35 C37-C39 = C2012X7R1A106K125AE: CAP CER 10UF 10V X7R 0805; manufacturer: TDK Corporation; Capacitance: 10 µF; Tolerance: ±10%; Part Number: C2012X7R1A106K125AE; Applications: Boardflex Sensitive; componentlink1description: Datasheet; componentlink1url: https://product.tdk.com/info/en/catalog/datasheets/mlcc_commercial_soft_en.pdf?ref_disty=digikey; componentlink2description: DigiKey Link; componentlink2url: https://www.digikey.com/en/products/detail/tdk-corporation/C2012X7R1A106K125AE/5809181; Device Package: 0805 (2012 Metric); Features: Soft Termination; lastupdated: 30/01/2024 20:15:17; Lifecycle Status: Active; Minimum Order: 1; Mounting Type: Surface Mount, MLCC; Operating Temperature: -55°C ~ 125°C; Package / Case: 0805 (2012 Metric); packaging: TapeAndReel; partid: 3036; Part Status: Active; price: 0.07; series: C; Size / Dimension: 0.079" L x 0.049" W (2.00mm x 1.25mm); Supplier 1: DigiKey; Supplier Part Number 1: 445-173616-1-ND; Temperature Coefficient: X7R; Thickness (Max): 0.059" (1.50mm); Voltage - Rated: 10V
C36 = VJ0805V225MXQTW1BC: CAP CER 2.2UF 10V Y5V 0805; manufacturer: Vishay Vitramon; Temperature Coefficient: Y5V (F); Tolerance: ±20%; Part Number: VJ0805V225MXQTW1BC; Applications: General Purpose; Capacitance: 2.2 µF; componentlink1description: Datasheet; componentlink1url: https://www.vishay.com/docs/28548/vjw1bcbascomseries.pdf; componentlink2description: DigiKey Link; componentlink2url: https://www.digikey.com/en/products/detail/vishay-vitramon/VJ0805V225MXQTW1BC/8310634; Device Package: 0805 (2012 Metric); lastupdated: 04/02/2024 20:15:35; Lifecycle Status: Active; Minimum Order: 1; Mounting Type: Surface Mount, MLCC; Operating Temperature: -25°C ~ 85°C; Package / Case: 0805 (2012 Metric); packaging: TapeAndReel; partid: 26419; Part Status: Active; price: 0.06; series: VJ; Size / Dimension: 0.079" L x 0.049" W (2.00mm x 1.25mm); Supplier 1: DigiKey; Supplier Part Number 1: 720-VJ0805V225MXQTW1BCCT-ND; Thickness (Max): 0.053" (1.35mm); Voltage - Rated: 10V
C40 C43-C47 = GMC02X5R224K16NT: CAP0201 X5R .22UF 10% 16V; manufacturer: Cal-Chip Electronics, Inc.; Value: 0.22 µF; Tolerance: ±10%; Part Number: GMC02X5R224K16NT; Applications: General Purpose; Capacitance: 0.22 µF; componentlink1description: Datasheet; componentlink1url: https://calchip.com/wp-content/uploads/2024/02/gmc_series-1.pdf; componentlink2description: DigiKey Link; componentlink2url: https://www.digikey.com/en/products/detail/cal-chip-electronics-inc/GMC02X5R224K16NT/22562848; Device Package: 0201 (0603 Metric); lastupdated: 04/06/2024 19:00:50; Lifecycle Status: Active; Minimum Order: 1; Mounting Type: Surface Mount, MLCC; Operating Temperature: -55°C ~ 85°C; Package / Case: 0201 (0603 Metric); packaging: TapeAndReel; partid: 57532; price: 0.01; series: GMC; Size / Dimension: 0.024" L x 0.012" W (0.60mm x 0.30mm); Supplier 1: DigiKey; Supplier Part Number 1: 4713-GMC02X5R224K16NTCT-ND; Temperature Coefficient: X5R; Thickness (Max): 0.013" (0.33mm); Voltage - Rated: 16V
C41 = CMP-001-00081-4: Chip Capacitor, 22µF +/-40%, 16V, 0805, Thickness 1.45 mm; Tolerance: 5%; Voltage Rating: 16V; Mounting Technology: SMT; Pins: 2; Max Operating Temperature: 85°C; Case/Package: 0805; Min Operating Temperature: -55°C
C42 = CMP-001-00082-4: Chip Capacitor, 47µF +/-40%, 6.3V, 0805, Thickness 1.45 mm; Tolerance: 10%; Min Operating Temperature: -55°C; Max Operating Temperature: 85°C; Case/Package: 0805; Pins: 2; Mounting Technology: SMT; Voltage Rating: 6.3V
C48 = 865060440001: WCAP-ASLL Aluminum Electrolytic Capacitor, V-Chip, D4 x H5.5mm, 10µF, 25V; Manufacturer: Wurth Elektronik; Capacitance Tolerance: +/-20%; Dissipation Factor: 14%; Endurance: 2000h; Leakage Current: 3uA; Ripple Current: 90mA; Technical Reference: ASEB055100M025DVCTAB000; Manufacturer Part Number: 865060440001; Category: Aluminum Electrolytic Capacitors; Match Code: WCAP-ASLL; ComponentLink1Description: Website Link; ComponentLink1URL: https://www.we-online.com/redexpert/article/865060440001?ad; ComponentLink2Description: Datasheet Link; ComponentLink2URL: https://www.we-online.com/redexpert/spec/865060440001?ad; Mount: Surface Mount; Operating Temperature Max: 105°C; Operating Temperature Min: -55°C; Packaging: Tape and Reel; Height: 5.5mm; Diameter: 4mm; Capacitance: 10uF; Rated Voltage (DC): 25V
C49-C56 C58 = EMK063BJ104KP-F: CAP CER 0.1UF 16V X5R 0201; manufacturer: Taiyo Yuden; Tolerance: ±10%; Value: 0.1 µF; Part Number: EMK063BJ104KP-F; Applications: SMPS Filtering; Capacitance: 0.1 µF; componentlink1description: Datasheet; componentlink1url: https://ds.yuden.co.jp/TYCOMPAS/ut/detail?pn=EMK063BJ104KP-F  &u=M; componentlink2description: DigiKey Link; componentlink2url: https://www.digikey.com/en/products/detail/taiyo-yuden/EMK063BJ104KP-F/4970625; Device Package: 0201 (0603 Metric); lastupdated: 04/06/2024 19:01:11; Lifecycle Status: Active; Minimum Order: 1; Mounting Type: Surface Mount, MLCC; Operating Temperature: -55°C ~ 85°C; Package / Case: 0201 (0603 Metric); packaging: TapeAndReel; partid: 12; price: 0.01; series: M; Supplier 1: DigiKey; Supplier Part Number 1: 587-5833-1-ND; Temperature Coefficient: X5R; Voltage - Rated: 16V; Size / Dimension: 0.024" L x 0.012" W (0.60mm x 0.30mm); Thickness (Max): 0.013" (0.33mm); Part Status: Active
C60-C62 = 02016C104KAT2A: 0201 6.3V X7R 100NF 10%; manufacturer: KYOCERA AVX; Value: 0.1 µF; Part Number: 02016C104KAT2A; Applications: General Purpose; Capacitance: 0.1 µF; componentlink1description: Datasheet; componentlink1url: https://datasheets.kyocera-avx.com/X7RDielectric.pdf; componentlink2description: DigiKey Link; componentlink2url: https://www.digikey.com/en/products/detail/kyocera-avx/02016C104KAT2A/17868582; Device Package: 0201 (0603 Metric); lastupdated: 04/06/2024 19:00:59; Lifecycle Status: Active; Minimum Order: 1; Mounting Type: Surface Mount, MLCC; Operating Temperature: -55°C ~ 125°C; Package / Case: 0201 (0603 Metric); packaging: TapeAndReel; partid: 47559; price: 0.06; series: -; Supplier 1: DigiKey; Supplier Part Number 1: 478-02016C104KAT2ACT-ND; Temperature Coefficient: X7R; Tolerance: ±10%; Voltage - Rated: 6.3V; Size / Dimension: 0.024" L x 0.012" W (0.60mm x 0.30mm); Thickness (Max): 0.013" (0.33mm); Part Status: Active
D10 = 3SMBJ5938B-TP: DIODE ZENER 36V 3W DO214AA; Manufacturer: Micro Commercial Co; Current - Reverse Leakage @ Vr: 1 µA @ 27.4 V; Impedance (Max) (Zzt): 38 Ohms; Tolerance: ±5%; Voltage - Forward (Vf) (Max) @ If: 1.5 V @ 200 mA; Part Number: 3SMBJ5938B-TP; ComponentLink1Description: Datasheet; ComponentLink1URL: https://www.mccsemi.com/pdf/Products/3SMBJ5913B~3SMBJ5943B(DO-214AA).pdf; ComponentLink2Description: DigiKey Link; ComponentLink2URL: https://www.digikey.com/en/products/detail/micro-commercial-co/3SMBJ5938B-TP/1114251; LastUpdated: 06/02/2024 21:26:34; Lifecycle Status: Active; Minimum Order: 1; Mounting Type: Surface Mount; Operating Temperature: -55°C ~ 150°C; Package / Case: DO-214AA, SMB; Packaging: TapeAndReel; PartId: 926; Part Status: Active; Power - Max: 3 W; Price: 0.07; Series: -; Supplier 1: DigiKey; Supplier Part Number 1: 3SMBJ5938BTPMSCT-ND; Supplier Device Package: DO-214AA (SMB); Voltage - Zener (Nom) (Vz): 36 V
D11 D13 = LED_0603_RED: LED 0603 RED SMD
D12 D18 D19 = CMP-004-00002-2: Fast Switching Diode, 75 V, 0.3 A, -65 to 150 degC, 2-Pin SOD323, RoHS, Tape and Reel; Manufacturer: Diodes Inc; Peak Reverse Current: 1uA; Max Surge Current: 2A; Elements: 1; Forward Current: 300mA; Recovery Time: 4ns; Forward Voltage: 1.25V; Datasheet Version: Rev. 25-2, 03/2016; Case/Package: SOD; Min Operating Temperature: -65°C; RoHS Compliant: True; Max Operating Temperature: 150°C; Manufacturer URL: http://www.diodes.com/; Pins: 2; Package Quantity: 3000; Datasheet URL: http://www.diodes.com/datasheets/ds30097.pdf; Packaging: TapeandReel; Package Description: 2-Pin Small Outline Diode, Body 1.7 x 1.3 mm; Mounting Technology: SM; Package Reference: SOD323-2
F1 = FUSE_PPTC_1206: Fuse PPTC SMD 1206; Manufacturer: *; Manufacturer Part Number: *
IC1#2 = R7FA8M1AHECBD#UC0: Integrated Circuit; Manufacturer_Name: Renesas Electronics; Datasheet Link: https://www.renesas.com/us/en/document/dst/ra8m1-group-datasheet?r=25447396; Height: 1.47mm; Manufacturer_Part_Number: R7FA8M1AHECBD#UC0; Mouser Part Number: 968-R7FA8M1AHECBDUC0; Mouser Price/Stock: https://www.mouser.co.uk/ProductDetail/Renesas-Electronics/R7FA8M1AHECBDUC0?qs=HoCaDK9Nz5en4LBg9VyLXw%3D%3D
IC6 = MIC5239-3.3YS-TR: Integrated Circuit; Manufacturer_Name: Microchip; Datasheet Link: https://ww1.microchip.com/downloads/en/DeviceDoc/mic5239.pdf; Height: 1.8mm; Manufacturer_Part_Number: MIC5239-3.3YS-TR; Mouser Part Number: 998-MIC5239-3.3YSTR; Mouser Price/Stock: https://www.mouser.co.uk/ProductDetail/Microchip-Technology-Micrel/MIC5239-33YS-TR?qs=U6T8BxXiZAXN0UitWWB92A%3D%3D; Arrow Part Number: MIC5239-3.3YS-TR; Arrow Price/Stock: https://www.arrow.com/en/products/mic5239-3.3ys-tr/microchip-technology?region=nac
J27 J32 J42 J43#2 J44#2 J45#2 J46#2 J47#2 J48#2 = Solder Bridge 805
J36-J40 = S7221-45R: EMI Gaskets, Sheets, Absorbers & Shielding EMC Spring Contact 1.23mm high; Manufacturer_Name: Harwin; Manufacturer_Part_Number: S7221-45R; Mouser Part Number: 855-S7221-45R; Mouser Price/Stock: https://www.mouser.co.uk/ProductDetail/Harwin/S7221-45R?qs=pffCcXpkxLxI%252B2oy4ryQHw%3D%3D; Arrow Part Number: *; Arrow Price/Stock: *; Datasheet Link: https://cdn.harwin.com/pdfs/S7221-45R.pdf; Geometry.Height: 1.23mm
J49#2 = Solder Bridge 805 Open
L1 = 74477005: WE-PD SMT Power Inductor, size 1280, 5.6uH, 8.7A, 13.5mOhm; Manufacturer: Wurth Elektronik; Case/Size Code: 1280; DC Resistance: 10.5mOhm; Saturation Current: 10A; Self Resonant Frequency: 24MHz; Type: Standard; Manufacturer Part Number: 74477005; Category: Power Inductors; Match Code: WE-PD; ComponentLink1Description: Website Link; ComponentLink1URL: https://www.we-online.com/redexpert/article/74477005?ad; ComponentLink2Description: Datasheet Link; ComponentLink2URL: https://www.we-online.com/redexpert/spec/74477005?ad; Mount: Surface Mount; Operating Temperature Max: 125°C; Operating Temperature Min: -40°C; Packaging: Tape and Reel; Length: 12mm; Width: 12mm; Height: 8mm; DC Resistance Max: 13.5mOhm; Inductance: 5.6uH; Rated Current: 8.7A
R37 R40 = RNCS0805BKE1K00: RES 1K OHM 0.1% 1/10W 0805; Manufacturer: Stackpole Electronics Inc; Power (Watts): 0.1W, 1/10W; Temperature Coefficient: ±25ppm/°C; Part Number: RNCS0805BKE1K00; Value: 1 kOhms; ComponentLink1Description: Datasheet; ComponentLink1URL: https://www.seielect.com/catalog/sei-rncs_rnch.pdf; ComponentLink2Description: DigiKey Link; ComponentLink2URL: https://www.digikey.com/en/products/detail/stackpole-electronics-inc/RNCS0805BKE1K00/1800073; Composition: Thin Film; Device Package: 0805 (2012 Metric); Features: Anti-Corrosive, Automotive AEC-Q200, Moisture Resistant; Height - Seated (Max): 0.026" (0.65mm); LastUpdated: 02/02/2024 21:00:48; Lifecycle Status: Active; Minimum Order: 1; Number of Terminations: 2; Operating Temperature: -55°C ~ 155°C; Package / Case: 0805 (2012 Metric); Packaging: TapeAndReel; PartId: 27715; Part Status: Active; Price: 0.07; Ratings: AEC-Q200; Resistance: 1 kOhms; Series: RNCS; Size / Dimension: 0.079" L x 0.049" W (2.00mm x 1.25mm); Supplier 1: DigiKey; Supplier Part Number 1: RNCS0805BKE1K00CT-ND; Supplier Device Package: 0805; Tolerance: ±0.1%
U1 = TSR 1-2450: No Description Available; Mfr_Name: Traco Power; Copyright: Copyright (C) 2024 Ultra Librarian. All rights reserved.; Manufacturer_Part_Number: TSR 1-2450; RefDes: RefDes; Type: DEV